# Altium project micromouse.PrjPcb
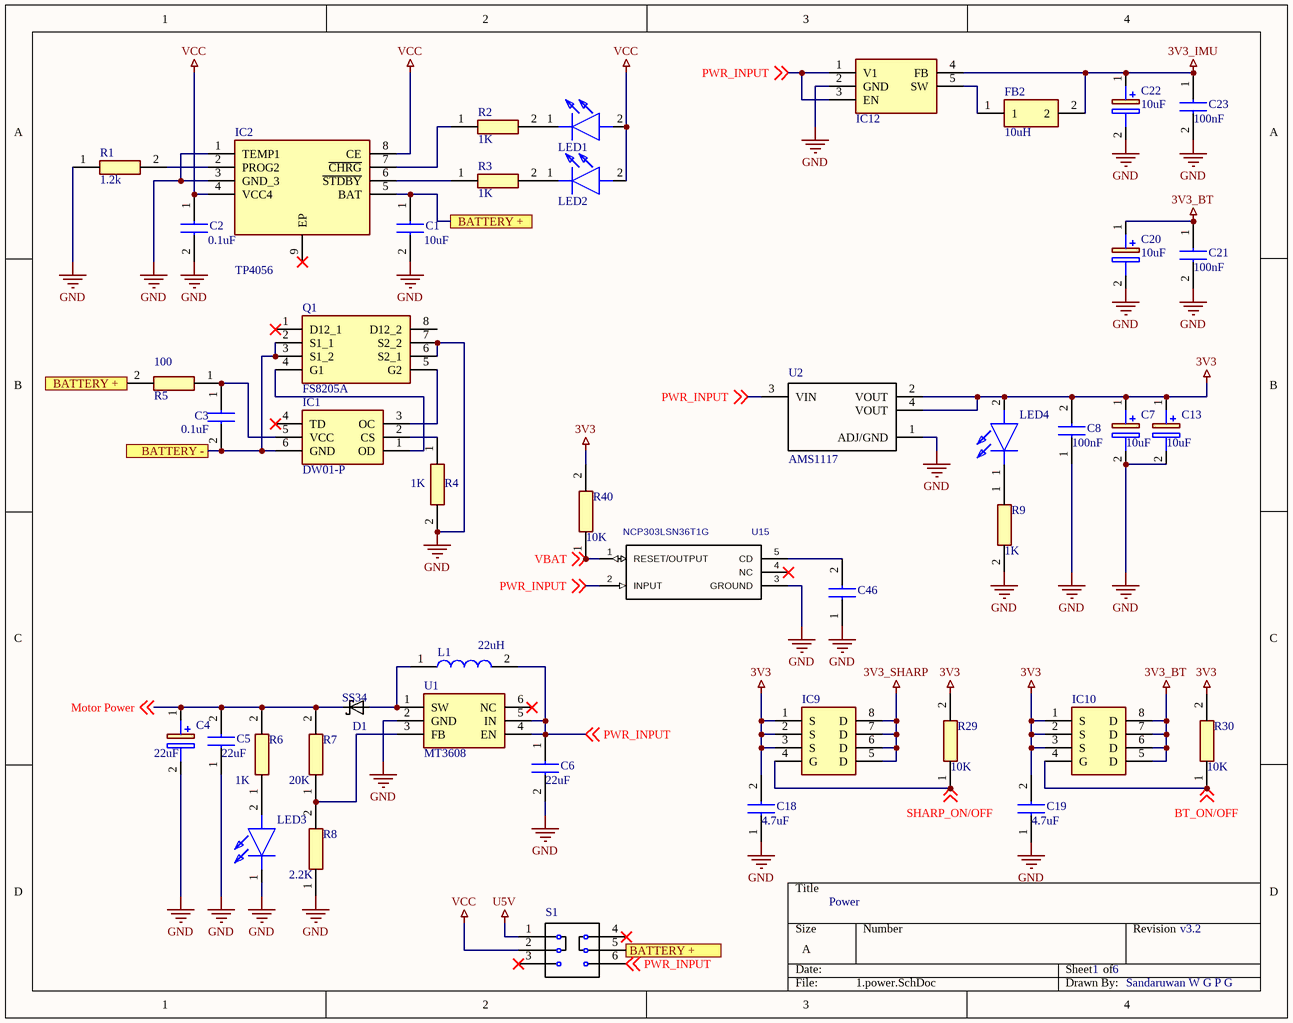
[diagram p0: 1.power.SchDoc]
Company: University of Peradeniya; Revision: V3
6 sheets, 164 parts. Net scope: flat (ports and power ports of the same name join across sheets).
Board file: micromouse pcb.PcbDoc
Sheets:
  1.power.SchDoc
  2.sensors.SchDoc
  3.motor drivers.SchDoc
  4.IMU.SchDoc
  5.Teensy.SchDoc
  6.STM32F103.SchDoc

## Sheet 1.power.SchDoc: Power Schematic
size A; DrawnBy: Pramod Sandaruwan; DocumentNumber: 1; Revision: V3; SheetNumber: 1; SheetTotal: 6

### Parts
C1  value 10uF  [CAPC2012X94N]  (hidden comment: 08055A101JAT2A)
C2  value 0.1uF  [CAPC2012X94N]  (hidden comment: 08055A101JAT2A)
C3  value 0.1uF  [CAPC2012X94N]  (hidden comment: 08055A101JAT2A)
C4  value 22uF  [CAPAE830X1050N]  (hidden comment: UUD1E221MNL1GS)
C5  value 22uF  [CAPC2012X94N]  (hidden comment: 08055A101JAT2A)
C6  value 22uF  [CAPC2012X94N]  (hidden comment: 08055A101JAT2A)
C7  value 10uF  [CAPPM3216X180N]  (hidden comment: tantalum capacitor 1206)
C8  value 100nF  [CAPC2012X94N]  (hidden comment: 08055A101JAT2A)
C13  value 10uF  [CAPPM3216X180N]  (hidden comment: tantalum capacitor 1206)
C18  value 4.7uF  [CAPC2012X94N]  (hidden comment: 08055A101JAT2A)
C19  value 4.7uF  [CAPC2012X94N]  (hidden comment: 08055A101JAT2A)
C20  value 10uF  [CAPPM3216X180N]  (hidden comment: tantalum capacitor 1206)
C21  value 100nF  [CAPC2012X94N]  (hidden comment: 08055A101JAT2A)
C22  value 10uF  [CAPPM3216X180N]  (hidden comment: tantalum capacitor 1206)
C23  value 100nF  [CAPC2012X94N]  (hidden comment: 08055A101JAT2A)
C46  08055A101JAT2A  [CAPC2012X94N]  (value not drawn)
D1  SS34  [*SMA]
FB2  value 10uH  [BEADC1608X95N]  (hidden comment: inductor 0603)
IC1  DW01-P  [SOT95P280X135-6N]
IC2  TP4056  [SOIC127P600X175-9N]
IC9  SI4143DY-T1-GE3  [SI4143DY-T1-GE3]  (value not drawn)
IC10  SI4143DY-T1-GE3  [SI4143DY-T1-GE3]  (value not drawn)
IC12  TPS62203  [SOT95P280X145-5N]  (value not drawn)
L1  value 22uH  [INDPM8080X420N]  (hidden comment: 74404084220)
LED1  150080BS75000  [LEDC2012X80N]  (value not drawn)
LED2  150080BS75000  [LEDC2012X80N]  (value not drawn)
LED3  150080BS75000  [LEDC2012X80N]  (value not drawn)
LED4  150080BS75000  [LEDC2012X80N]  (value not drawn)
Q1  FS8205A  [SOP65P640X120-8N]
R1  value 1.2k  [RESC2012X65N]  (hidden comment: CPF0805B100KE)
R2  value 1K  [RESC2012X65N]  (hidden comment: CPF0805B100KE)
R3  value 1K  [RESC2012X65N]  (hidden comment: CPF0805B100KE)
R4  value 1K  [RESC2012X65N]  (hidden comment: CPF0805B100KE)
R5  value 100  [RESC2012X65N]  (hidden comment: CPF0805B100KE)
R6  value 1K  [RESC2012X65N]  (hidden comment: CPF0805B100KE)
R7  value 20K  [RESC2012X65N]  (hidden comment: CPF0805B100KE)
R8  value 2.2K  [RESC2012X65N]  (hidden comment: CPF0805B100KE)
R9  value 1K  [RESC2012X65N]  (hidden comment: CPF0805B100KE)
R29  value 10K  [RESC2012X65N]  (hidden comment: CPF0805)
R30  value 10K  [RESC2012X65N]  (hidden comment: CPF0805)
R40  value 10K  [RESC2012X65N]  (hidden comment: CPF0805)
S1  1-1437575-7  [*SW_1-1437575-7]  (value not drawn)
U1  MT3608  [SOT95P280X145-6N]
U2  AMS1117  [*SOT229P700X180-4N]
U15  NCP303LSN36T1G  [TSOP-5]

### Ports
BATTERY +, BATTERY -

### Nets
3V3: C7.1(+) C8.2 C13.1(+) C18.2 C19.2 IC9.1(S) IC9.2(S) IC9.3(S) IC10.1(S) IC10.2(S) IC10.3(S) LED4.2(A) R29.2 R30.2 R40.2 U2.2(VOUT) U2.4(VOUT)
3V3_BT: C20.1(+) C21.1 IC10.5(D) IC10.6(D) IC10.7(D) IC10.8(D)
3V3_IMU: C22.1(+) C23.1 FB2.2 IC12.4(FB)
3V3_SHARP: IC9.5(D) IC9.6(D) IC9.7(D) IC9.8(D)
GND: C1.2 C2.2 C4.2(-) C5.1 C6.2 C7.2(-) C8.1 C13.2(-) C18.1 C19.1 C20.2(-) C21.2 C22.2(-) C23.2 C46.1 IC2.1(TEMP1) IC2.3(GND_3) IC12.2(GND) LED3.1(K) Q1.6(S2_1) Q1.7(S2_2) R1.1 R4.2 R8.1 R9.2 U1.2(GND) U2.1(ADJ/GND) U15.3(GROUND)
U5V: S1.1
VCC: C2.1 IC2.4(VCC4) IC2.8(CE) LED1.2(A) LED2.2(A) S1.2
BT_ON/OFF: IC10.4(G) R30.1 ; off-sheet BT_ON/OFF
Motor Power: C4.1(+) C5.2 D1.C R6.2 R7.2 ; off-sheet Motor Power
PWR_INPUT: C6.1 IC12.1(V1) IC12.3(EN) L1.2 S1.6 U1.4(EN) U1.5(IN) U2.3(VIN) U15.2(INPUT) ; off-sheet PWR_INPUT
SHARP_ON/OFF: IC9.4(G) R29.1 ; off-sheet SHARP_ON/OFF
VBAT: R40.1 U15.1(RESET/OUTPUT) ; off-sheet VBAT
NetC1_1: C1.1 IC2.5(BAT) R5.2 S1.5 ; port BATTERY +
NetC3_1: C3.1 IC1.5(VCC) R5.1
NetC3_2: C3.2 IC1.6(GND) Q1.2(S1_1) Q1.3(S1_2) ; port BATTERY -
NetC46_2: C46.2 U15.5(CD)
NetD1_A: D1.A L1.1 U1.1(SW)
NetFB2_1: FB2.1 IC12.5(SW)
NetIC1_1: IC1.1(OD) Q1.4(G1)
NetIC1_2: IC1.2(CS) R4.1
NetIC1_3: IC1.3(OC) Q1.5(G2)
NetIC2_2: IC2.2(PROG2) R1.2
NetIC2_6: IC2.6(~{STDBY}) R3.1
NetIC2_7: IC2.7(~{CHRG}) R2.1
NetLED1_1: LED1.1(K) R2.2
NetLED2_1: LED2.1(K) R3.2
NetLED3_2: LED3.2(A) R6.1
NetLED4_1: LED4.1(K) R9.1
NetR7_1: R7.1 R8.2 U1.3(FB)

Not connected (* = marked no-connect by the designer): IC1 4(TD)*; IC2 9(EP)*; Q1 1(D12_1)* 8(D12_2); S1 3* 4*; U1 6(NC)*; U15 4(NC)*

### Notes on the sheet
- Power
- v3.2
- Sandaruwan W G P G

### Library data of the parts
C1-C3 C5 C6 C8 C18 C19 C21 C23 C46 = 08055A101JAT2A: Capacitor; Manufacturer_Name: AVX; Allied_Number: 70474488; Datasheet Link: https://componentsearchengine.com/Datasheets/1/06031A100FAT2A.pdf; Height: 0.94mm; Manufacturer_Part_Number: 08055A101JAT2A; Mouser Part Number: 581-08055A101J; Mouser Price/Stock: https://www.mouser.com/Search/Refine.aspx?Keyword=581-08055A101J; RS Part Number: 0391000P; RS Price/Stock: http://uk.rs-online.com/web/p/products/0391000P; Allied Price/Stock: https://www.alliedelec.com/avx-08055a101jat2a/70474488/
C4 = UUD1E221MNL1GS: Capacitor Polarised; Manufacturer_Name: Nichicon; Allied_Number: 70409814; Datasheet Link: https://www.mouser.com/datasheet/2/293/e-uud-1513238.pdf; Height: 10.5mm; Manufacturer_Part_Number: UUD1E221MNL1GS; Mouser1 Part Number: 647-UUD1E221MNL; Mouser1 Price/Stock: https://www.mouser.com/Search/Refine.aspx?Keyword=647-UUD1E221MNL; RS Part Number: 7393453P; RS Price/Stock: http://uk.rs-online.com/web/p/products/7393453P; Allied Price/Stock: https://www.alliedelec.com/nichicon-uud1e221mnl1gs/70409814/
C7 C13 C20 C22 = tantalum capacitor 1206: Capacitor Polarised
D1 = SS34_1: Diode Schottky 40V 3A 2-Pin SMC T/R; MF: ON Semiconductor; MP: SS34; SnapEDA_Link: https://www.snapeda.com/parts/SS34/ON%20Semiconductor/view-part/?ref=snap; Price: None; Package: DO-214AB-214 ON Semiconductor; Availability: Unavailable; Value: *
FB2 = inductor 0603: Ferrite Bead
IC1 = DW01-P: Integrated Circuit; Manufacturer_Name: Fortune Semiconductor Corporation; Datasheet Link: https://cdn.sparkfun.com/assets/learn_tutorials/2/5/1/DW01-P_DataSheet_V10.pdf; Height: 1.35mm; Manufacturer_Part_Number: DW01-P
IC2 = TP4056: Integrated Circuit; Manufacturer_Name: NanJing Top Power; Datasheet Link: https://dlnmh9ip6v2uc.cloudfront.net/datasheets/Prototyping/TP4056.pdf; Height: 1.75mm; Manufacturer_Part_Number: TP4056
IC9 IC10 = SI4143DY-T1-GE3: Integrated Circuit
IC12 = TPS62203: Integrated Circuit
L1 = 74404084220: Inductor; Manufacturer_Name: Wurth Elektronik; Datasheet Link: https://katalog.we-online.de/pbs/datasheet/74404084220.pdf; Height: 4.2mm; Manufacturer_Part_Number: 74404084220; Mouser Part Number: 710-74404084220; Mouser Price/Stock: https://www.mouser.com/Search/Refine.aspx?Keyword=710-74404084220; RS Part Number: 8164733P; RS Price/Stock: http://uk.rs-online.com/web/p/products/8164733P
LED1-LED4 = 150080BS75000: LED; Manufacturer_Name: Wurth Elektronik; Datasheet Link: https://katalog.we-online.com/led/datasheet/150080BS75000.pdf; Height: 0.8mm; Manufacturer_Part_Number: 150080BS75000; Mouser Part Number: 710-150080BS75000; Mouser Price/Stock: https://www.mouser.com/Search/Refine.aspx?Keyword=710-150080BS75000; RS Part Number: 8154228P; RS Price/Stock: http://uk.rs-online.com/web/p/products/8154228P
Q1 = FS8205A: Transistor; Manufacturer_Name: SII Semiconductor; Datasheet Link: http://www.ic-fortune.com/upload/Download/FS8205A-DS-12_EN.pdf; Height: 1.2mm; Manufacturer_Part_Number: FS8205A
R1-R9 = CPF0805B100KE: Resistor; Manufacturer_Name: TE Connectivity; Allied_Number: 70286772; Datasheet Link: http://docs-europe.electrocomponents.com/webdocs/13d1/0900766b813d116f.pdf; Height: 0.65mm; Manufacturer_Part_Number: CPF0805B100KE; Mouser Part Number: 279-CPF0805B100KE; Mouser Price/Stock: https://www.mouser.com/Search/Refine.aspx?Keyword=279-CPF0805B100KE; RS Part Number: 6662673; RS Price/Stock: https://uk.rs-online.com/web/p/products/6662673; Allied Price/Stock: https://www.alliedelec.com/te-connectivity-cpf0805b100ke/70286772/
R29 R30 R40 = CPF0805: Resistor; Manufacturer_Name: TE Connectivity; Manufacturer_Part_Number: CPF0805B100KE; Allied_Number: 70286772; Datasheet Link: http://docs-europe.electrocomponents.com/webdocs/13d1/0900766b813d116f.pdf; Height: 0.65mm; Mouser Part Number: 279-CPF0805B100KE; Mouser Price/Stock: https://www.mouser.com/Search/Refine.aspx?Keyword=279-CPF0805B100KE; RS Part Number: 6662673; RS Price/Stock: https://uk.rs-online.com/web/p/products/6662673; Allied Price/Stock: https://www.alliedelec.com/te-connectivity-cpf0805b100ke/70286772/
S1 = 1-1437575-7: Slide Switch ON ON DPDT Top Slide 0.4VA 20VAC 20VDC 10000Cycle PC Pins Through Hole; MF: TE Connectivity; Price: None; Package: None; MP: 1-1437575-7; SnapEDA_Link: https://www.snapeda.com/parts/1-1437575-7/TE%20Connectivity%20ALCOSWITCH%20Switches/view-part/?ref=snap; Availability: Unavailable; TE_purchase_URL: https://www.te.com/usa-en/product-1-1437575-7.html?te_bu=Cor&te_type=disp&te_campaign=seda_glo_cor-seda-global-disp-prtnr-fy19-seda-model-bom-cta_sma-317_1&elqCampaignId=32493; Value: *
U1 = MT3608: Undefined or Miscellaneous; Manufacturer_Name: Aerosemi; Datasheet Link: https://www.olimex.com/Products/Breadboarding/BB-PWR-3608/resources/MT3608.pdf; Height: 1.45mm; Manufacturer_Part_Number: MT3608
U2 = AMS1117: 1A LOW DROPOUT VOLTAGE REGULATOR; MF: Seeed Technology; MP: AMS1117; SnapEDA_Link: https://www.snapeda.com/parts/AMS1117/Seeed%20Technology%20Co.%2C%20Ltd/view-part/?ref=snap; Price: None; Package: SOT-223 Seeed Technology; Availability: Unavailable; Value: *
U15 = NCP303LSN36T1G: C: Copyright (C) 2016 Accelerated Designs. All rights reserved; Vendor: ON Semiconductor; Value: NCP303LSN36T1G; Manufacturer_Part_Number: NCP303LSN36T1G; Copyright: Copyright (C) 2016 Accelerated Designs. All rights reserved

## Sheet 2.sensors.SchDoc: Sensor Schematic
size A; DocumentNumber: 2; Revision: V3; SheetNumber: 2; SheetTotal: 6
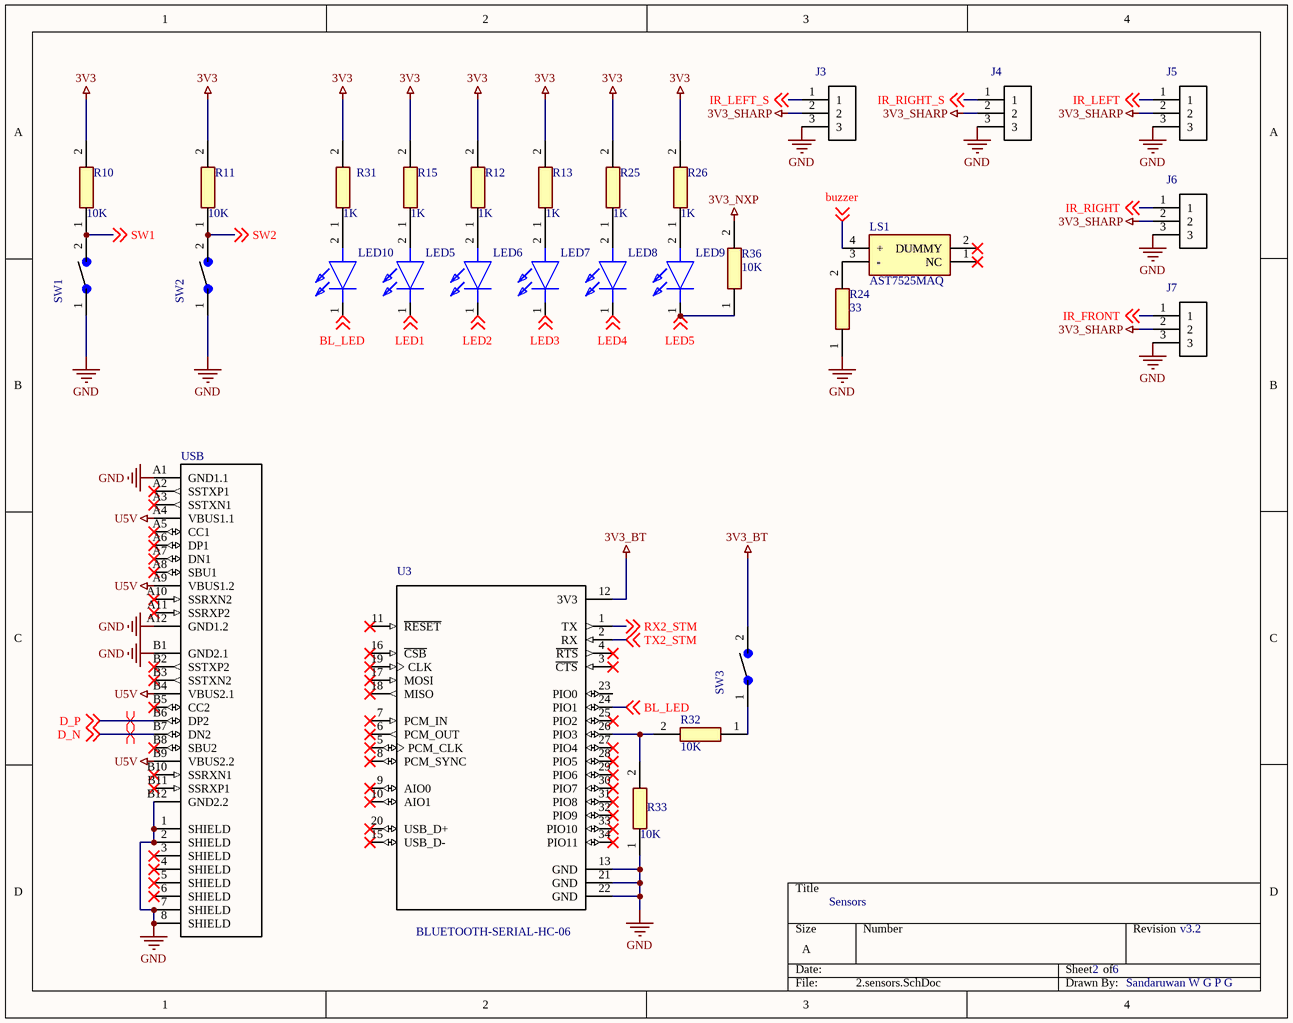
[diagram p1: 2.sensors.SchDoc]

### Parts
J3  0022057035_5268-03A  [*MOLEX_0022057035_5268-03A]  (value not drawn)
J4  0022057035_5268-03A  [*MOLEX_0022057035_5268-03A]  (value not drawn)
J5  0022057035_5268-03A  [*MOLEX_0022057035_5268-03A]  (value not drawn)
J6  0022057035_5268-03A  [*MOLEX_0022057035_5268-03A]  (value not drawn)
J7  0022057035_5268-03A  [*MOLEX_0022057035_5268-03A]  (value not drawn)
LED5  150080BS75000  [LEDC2012X80N]  (value not drawn)
LED6  150080BS75000  [LEDC2012X80N]  (value not drawn)
LED7  150080BS75000  [LEDC2012X80N]  (value not drawn)
LED8  150080BS75000  [LEDC2012X80N]  (value not drawn)
LED9  150080BS75000  [LEDC2012X80N]  (value not drawn)
LED10  150080BS75000  [LEDC2012X80N]  (value not drawn)
LS1  AST7525MAQ  [AST7525MAQ]
R10  value 10K  [RESC2012X65N]  (hidden comment: CPF0805B100KE)
R11  value 10K  [RESC2012X65N]  (hidden comment: CPF0805B100KE)
R12  value 1K  [RESC2012X65N]  (hidden comment: CPF0805B100KE)
R13  value 1K  [RESC2012X65N]  (hidden comment: CPF0805B100KE)
R15  value 1K  [RESC2012X65N]  (hidden comment: CPF0805B100KE)
R24  value 33  [RESC1608X55N]  (hidden comment: resistor)
R25  value 1K  [RESC2012X65N]  (hidden comment: CPF0805B100KE)
R26  value 1K  [RESC2012X65N]  (hidden comment: CPF0805B100KE)
R31  value 1K  [RESC2012X65N]  (hidden comment: CPF0805)
R32  value 10K  [RESC2012X65N]  (hidden comment: CPF0805)
R33  value 10K  [RESC2012X65N]  (hidden comment: CPF0805)
R36  value 10K  [RESC1608X55N]  (hidden comment: resistor)
SW1  1437566-3  [*TE_FSMSM]  (value not drawn)
SW2  1437566-3  [*TE_FSMSM]  (value not drawn)
SW3  1437566-3  [*TE_FSMSM]  (value not drawn)
U3  BLUETOOTH-SERIAL-HC-06  [*XCVR_BLUETOOTH-SERIAL-HC-06]
USB  USB4070-XX-X_REVC  [*GCT_USB4070-XX-X_REVC_USB4070-XX-X_REVC(Primary)]  (value not drawn)

### Nets
3V3: R10.2 R11.2 R12.2 R13.2 R15.2 R25.2 R26.2 R31.2
3V3_BT: SW3.2 U3.12(3V3)
3V3_NXP: R36.2
3V3_SHARP: J3.2 J4.2 J5.2 J6.2 J7.2
GND: J3.3 J4.3 J5.3 J6.3 J7.3 R24.1 R33.1 SW1.1 SW2.1 U3.13(GND) U3.21(GND) U3.22(GND) USB.1(SHIELD) USB.2(SHIELD) USB.7(SHIELD) USB.8(SHIELD) USB.A1(GND1.1) USB.A12(GND1.2) USB.B1(GND2.1) USB.B12(GND2.2)
U5V: USB.A4(VBUS1.1) USB.A9(VBUS1.2) USB.B4(VBUS2.1) USB.B9(VBUS2.2)
BL_LED: LED10.1(K) U3.24(PIO1) ; off-sheet BL_LED
buzzer: LS1.4(+) ; off-sheet buzzer
D_N: USB.B7(DN2) ; off-sheet D_N
D_P: USB.B6(DP2) ; off-sheet D_P
IR_FRONT: J7.1 ; off-sheet IR_FRONT
IR_LEFT: J5.1 ; off-sheet IR_LEFT
IR_LEFT_S: J3.1 ; off-sheet IR_LEFT_S
IR_RIGHT: J6.1 ; off-sheet IR_RIGHT
IR_RIGHT_S: J4.1 ; off-sheet IR_RIGHT_S
LED1: LED5.1(K) ; off-sheet LED1
LED2: LED6.1(K) ; off-sheet LED2
LED3: LED7.1(K) ; off-sheet LED3
LED4: LED8.1(K) ; off-sheet LED4
LED5: LED9.1(K) R36.1 ; off-sheet LED5
RX2_STM: U3.1(TX) ; off-sheet RX2_STM
SW1: R10.1 SW1.2 ; off-sheet SW1
SW2: R11.1 SW2.2 ; off-sheet SW2
TX2_STM: U3.2(RX) ; off-sheet TX2_STM
NetLED5_2: LED5.2(A) R15.1
NetLED6_2: LED6.2(A) R12.1
NetLED7_2: LED7.2(A) R13.1
NetLED8_2: LED8.2(A) R25.1
NetLED9_2: LED9.2(A) R26.1
NetLED10_2: LED10.2(A) R31.1
NetLS1_3: LS1.3(-) R24.2
NetR32_1: R32.1 SW3.1
NetR32_2: R32.2 R33.2 U3.26(PIO3)

Not connected (* = marked no-connect by the designer): LS1 1(NC)* 2(DUMMY)*; U3 3(~{CTS})* 4(~{RTS})* 5(PCM_CLK)* 6(PCM_OUT)* 7(PCM_IN)* 8(PCM_SYNC)* 9(AIO0)* 10(AIO1)* 11(~{RESET})* 15(USB_D-)* 16(~{CSB})* 17(MOSI)* 18(MISO)* 19(CLK)* 20(USB_D+)* 23(PIO0) 25(PIO2)* 27(PIO4)* 28(PIO5)* 29(PIO6)* 30(PIO7)* 31(PIO8)* 32(PIO9)* 33(PIO10)* 34(PIO11)*; USB 3(SHIELD)* 4(SHIELD)* 5(SHIELD)* 6(SHIELD)* A2(SSTXP1)* A3(SSTXN1)* A5(CC1)* A6(DP1)* A7(DN1)* A8(SBU1)* A10(SSRXN2)* A11(SSRXP2)* B2(SSTXP2)* B3(SSTXN2)* B5(CC2)* B8(SBU2)* B10(SSRXN1)* B11(SSRXP1)*

### Layout directives
differential pair: D_N, D_P

### Notes on the sheet
- Sensors
- v3.2
- Sandaruwan W G P G

### Library data of the parts
J3-J7 = 0022057035_5268-03A: Socket; wire-board; male; PIN: 3; 2.5mm; THT; SPOX; 3A; tinned; 20; MP: 0022057035 5268-03A; MF: Molex; Availability: Unavailable; Package: None; Price: None; SnapEDA_Link: https://www.snapeda.com/parts/0022057035%205268-03A/Molex/view-part/?ref=snap; Value: *
LED5-LED10 = 150080BS75000: LED; Manufacturer_Name: Wurth Elektronik; Datasheet Link: https://katalog.we-online.com/led/datasheet/150080BS75000.pdf; Height: 0.8mm; Manufacturer_Part_Number: 150080BS75000; Mouser Part Number: 710-150080BS75000; Mouser Price/Stock: https://www.mouser.com/Search/Refine.aspx?Keyword=710-150080BS75000; RS Part Number: 8154228P; RS Price/Stock: http://uk.rs-online.com/web/p/products/8154228P
LS1 = AST7525MAQ: Loudspeaker or Buzzer; Manufacturer_Name: Mallory Sonalert; Allied_Number: 70186690; Datasheet Link: https://www.mspindy.com/specifications/AST7525MAQ.PDF; Height: 2.5mm; Manufacturer_Part_Number: AST7525MAQ; Mouser Part Number: 539-AST7525MAQ; Mouser Price/Stock: https://www.mouser.com/Search/Refine.aspx?Keyword=539-AST7525MAQ; Allied Price/Stock: https://www.alliedelec.com/mallory-sonalert-ast7525maq/70186690/
R10-R13 R15 R25 R26 = CPF0805B100KE: as R1 on sheet 1.power; Datasheet Link: http://docs-europe.electrocomponents.com/webdocs/13d1/0900766b813d116f.pdf; Height: 0.65mm; Manufacturer_Part_Number: CPF0805B100KE; Mouser Part Number: 279-CPF0805B100KE; Mouser Price/Stock: https://www.mouser.com/Search/Refine.aspx?Keyword=279-CPF0805B100KE; RS Part Number: 6662673; RS Price/Stock: https://uk.rs-online.com/web/p/products/6662673; Allied Price/Stock: https://www.alliedelec.com/te-connectivity-cpf0805b100ke/70286772/
R31-R33 = CPF0805: as R29 on sheet 1.power; Datasheet Link: http://docs-europe.electrocomponents.com/webdocs/13d1/0900766b813d116f.pdf; Height: 0.65mm; Mouser Part Number: 279-CPF0805B100KE; Mouser Price/Stock: https://www.mouser.com/Search/Refine.aspx?Keyword=279-CPF0805B100KE; RS Part Number: 6662673; RS Price/Stock: https://uk.rs-online.com/web/p/products/6662673; Allied Price/Stock: https://www.alliedelec.com/te-connectivity-cpf0805b100ke/70286772/
SW1-SW3 = FSMSM: Switch Tactile OFF _ON_ SPST Rectangular Button Gull Wing 0.05A 12VDC SMD Loose Piece; MF: TE Connectivity; Configuration_Pole-Throw: Single Pole - Single Throw; Contact_Current_Rating: 50 mA; Availability: Unavailable; Price: None; Package: None; SnapEDA_Link: https://www.snapeda.com/parts/FSMSM/TE%20Connectivity%20ALCOSWITCH%20Switches/view-part/?ref=snap; MP: FSMSM; TE_purchase_URL: https://www.te.com/usa-en/product-1437566-3.html?te_bu=Cor&te_type=disp&te_campaign=seda_glo_cor-seda-global-disp-prtnr-fy19-seda-model-bom-cta_sma-317_1&elqCampaignId=32493; Value: *
U3 = BLUETOOTH-SERIAL-HC-06: Bluetooth Modules _802.15.1_ BLUETOOTH-SERIAL-HC-06; MF: Olimex; Price: None; MP: BLUETOOTH-SERIAL-HC-06; Package: None; SnapEDA_Link: https://www.snapeda.com/parts/BLUETOOTH-SERIAL-HC-06/Olimex/view-part/?ref=snap; Availability: Unavailable; Value: *
USB = USB4070-XX-X_REVC: Usb Type c Rec. 30 , Vertical, Smt With Stakes & Pegs, Tray; MP: USB4070-30-B; MF: Global Connector Technology; SnapEDA_Link: https://www.snapeda.com/parts/USB4070-30-B/Global%20Connector%20Technology/view-part/?ref=snap; Package: None; Price: None; Availability: Unavailable; Value: *

## Sheet 3.motor drivers.SchDoc
size A; DocumentNumber: 3; SheetNumber: 3; SheetTotal: 6
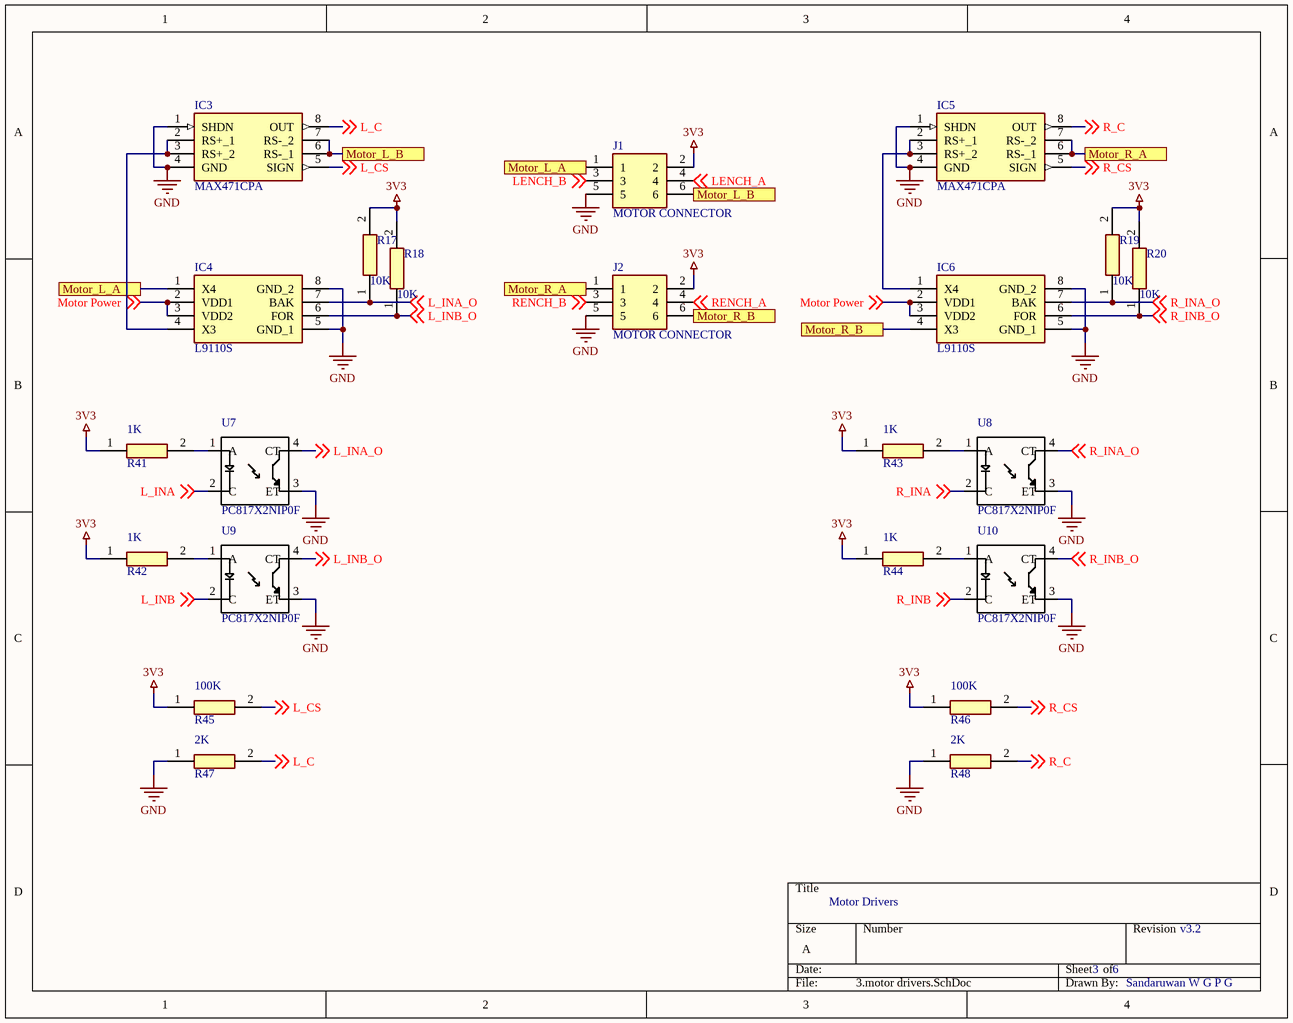
[diagram p2: 3.motor drivers.SchDoc]

### Parts
IC3  MAX471CPA  [SOIC127P600X175-8N]
IC4  L9110S  [SOIC127P600X175-8N]
IC5  MAX471CPA  [SOIC127P600X175-8N]
IC6  L9110S  [SOIC127P600X175-8N]
J1  MOTOR CONNECTOR  [533980671]
J2  MOTOR CONNECTOR  [533980671]
R17  value 10K  [RESC2012X65N]  (hidden comment: CPF0805B100KE)
R18  value 10K  [RESC2012X65N]  (hidden comment: CPF0805B100KE)
R19  value 10K  [RESC2012X65N]  (hidden comment: CPF0805B100KE)
R20  value 10K  [RESC2012X65N]  (hidden comment: CPF0805B100KE)
R41  value 1K  [RESC2012X65N]  (hidden comment: CPF0805)
R42  value 1K  [RESC2012X65N]  (hidden comment: CPF0805)
R43  value 1K  [RESC2012X65N]  (hidden comment: CPF0805)
R44  value 1K  [RESC2012X65N]  (hidden comment: CPF0805)
R45  value 100K  [RESC2012X65N]  (hidden comment: CPF0805)
R46  value 100K  [RESC2012X65N]  (hidden comment: CPF0805)
R47  value 2K  [RESC2012X65N]  (hidden comment: CPF0805)
R48  value 2K  [RESC2012X65N]  (hidden comment: CPF0805)
U7  PC817X2NIP0F  [*SOT254P975X400-4N]
U8  PC817X2NIP0F  [*SOT254P975X400-4N]
U9  PC817X2NIP0F  [*SOT254P975X400-4N]
U10  PC817X2NIP0F  [*SOT254P975X400-4N]

### Ports
Motor_L_A, Motor_L_B, Motor_R_A, Motor_R_B

### Nets
3V3: J1.2 J2.2 R17.2 R18.2 R19.2 R20.2 R41.1 R42.1 R43.1 R44.1 R45.1 R46.1
GND: IC3.1(SHDN) IC3.4(GND) IC4.5(GND_1) IC4.8(GND_2) IC5.1(SHDN) IC5.4(GND) IC6.5(GND_1) IC6.8(GND_2) J1.5 J2.5 R47.1 R48.1 U7.3(ET) U8.3(ET) U9.3(ET) U10.3(ET)
L_C: IC3.8(OUT) R47.2 ; off-sheet L_C
L_CS: IC3.5(SIGN) R45.2 ; off-sheet L_CS
L_INA: U7.2(C) ; off-sheet L_INA
L_INA_O: IC4.7(BAK) R17.1 U7.4(CT) ; off-sheet L_INA_O
L_INB: U9.2(C) ; off-sheet L_INB
L_INB_O: IC4.6(FOR) R18.1 U9.4(CT) ; off-sheet L_INB_O
LENCH_A: J1.4 ; off-sheet LENCH_A
LENCH_B: J1.3 ; off-sheet LENCH_B
Motor Power: IC4.2(VDD1) IC4.3(VDD2) IC6.2(VDD1) IC6.3(VDD2) ; off-sheet Motor Power
R_C: IC5.8(OUT) R48.2 ; off-sheet R_C
R_CS: IC5.5(SIGN) R46.2 ; off-sheet R_CS
R_INA: U8.2(C) ; off-sheet R_INA
R_INA_O: IC6.7(BAK) R19.1 U8.4(CT) ; off-sheet R_INA_O
R_INB: U10.2(C) ; off-sheet R_INB
R_INB_O: IC6.6(FOR) R20.1 U10.4(CT) ; off-sheet R_INB_O
RENCH_A: J2.4 ; off-sheet RENCH_A
RENCH_B: J2.3 ; off-sheet RENCH_B
NetIC3_2: IC3.2(RS+_1) IC3.3(RS+_2) IC4.4(X3)
NetIC3_6: IC3.6(RS-_1) IC3.7(RS-_2) J1.6 ; port Motor_L_B
NetIC4_1: IC4.1(X4) J1.1 ; port Motor_L_A
NetIC5_2: IC5.2(RS+_1) IC5.3(RS+_2) IC6.1(X4)
NetIC5_6: IC5.6(RS-_1) IC5.7(RS-_2) J2.1 ; port Motor_R_A
NetIC6_4: IC6.4(X3) J2.6 ; port Motor_R_B
NetR41_2: R41.2 U7.1(A)
NetR42_2: R42.2 U9.1(A)
NetR43_2: R43.2 U8.1(A)
NetR44_2: R44.2 U10.1(A)

### Notes on the sheet
- Motor Drivers
- v3.2
- Sandaruwan W G P G

### Library data of the parts
IC3 IC5 = MAX471CPA: Integrated Circuit; Manufacturer_Name: Maxim Integrated; Datasheet Link: https://pdfserv.maximintegrated.com/en/ds/MAX471-MAX472.pdf; Height: 1.75mm; Manufacturer_Part_Number: MAX471CPA; Mouser Part Number: 700-MAX471CPANR; Mouser Price/Stock: https://www.mouser.com/Search/Refine.aspx?Keyword=700-MAX471CPANR; RS Part Number: 0810352; RS Price/Stock: http://uk.rs-online.com/web/p/products/0810352
IC4 IC6 = L9110S: Integrated Circuit; Manufacturer_Name: Wuxi I-core Elec; Datasheet Link: https://datasheet.lcsc.com/szlcsc/Wuxi-Zhongwei-Aisin-Elec-L9110S_C85174.pdf; Height: 1.75mm; Manufacturer_Part_Number: L9110S
J1 J2 = 53398-0671: Connector; Manufacturer_Name: Molex; Allied_Number: 70090674; Datasheet Link: http://docs-emea.rs-online.com/webdocs/13c4/0900766b813c4502.pdf; Manufacturer_Part_Number: 53398-0671; Mouser Part Number: 538-53398-0671; Mouser Price/Stock: https://www.mouser.com/Search/Refine.aspx?Keyword=538-53398-0671; RS Part Number: 5427214P; RS Price/Stock: http://uk.rs-online.com/web/p/products/5427214P; Allied Price/Stock: http://www.alliedelec.com/molex-incorporated-53398-0671/70090674/
R17-R20 = CPF0805B100KE: as R1 on sheet 1.power; Datasheet Link: http://docs-europe.electrocomponents.com/webdocs/13d1/0900766b813d116f.pdf; Height: 0.65mm; Manufacturer_Part_Number: CPF0805B100KE; Mouser Part Number: 279-CPF0805B100KE; Mouser Price/Stock: https://www.mouser.com/Search/Refine.aspx?Keyword=279-CPF0805B100KE; RS Part Number: 6662673; RS Price/Stock: https://uk.rs-online.com/web/p/products/6662673; Allied Price/Stock: https://www.alliedelec.com/te-connectivity-cpf0805b100ke/70286772/
R41-R48 = CPF0805: as R29 on sheet 1.power; Datasheet Link: http://docs-europe.electrocomponents.com/webdocs/13d1/0900766b813d116f.pdf; Height: 0.65mm; Mouser Part Number: 279-CPF0805B100KE; Mouser Price/Stock: https://www.mouser.com/Search/Refine.aspx?Keyword=279-CPF0805B100KE; RS Part Number: 6662673; RS Price/Stock: https://uk.rs-online.com/web/p/products/6662673; Allied Price/Stock: https://www.alliedelec.com/te-connectivity-cpf0805b100ke/70286772/
U7-U10 = PC817X2NIP0F: Optocoupler DC-IN 1-CH Transistor DC-OUT 4-Pin PDIP SMD; MF: Sharp Microelectronics; Package: SMD-4 Sharp; Price: None; SnapEDA_Link: https://www.snapeda.com/parts/PC817X2NIP0F/Sharp%20Microelectronics/view-part/?ref=snap; MP: PC817X2NIP0F; Availability: Unavailable; Value: *

## Sheet 4.IMU.SchDoc
size A; DocumentNumber: 4; SheetNumber: 4; SheetTotal: 6
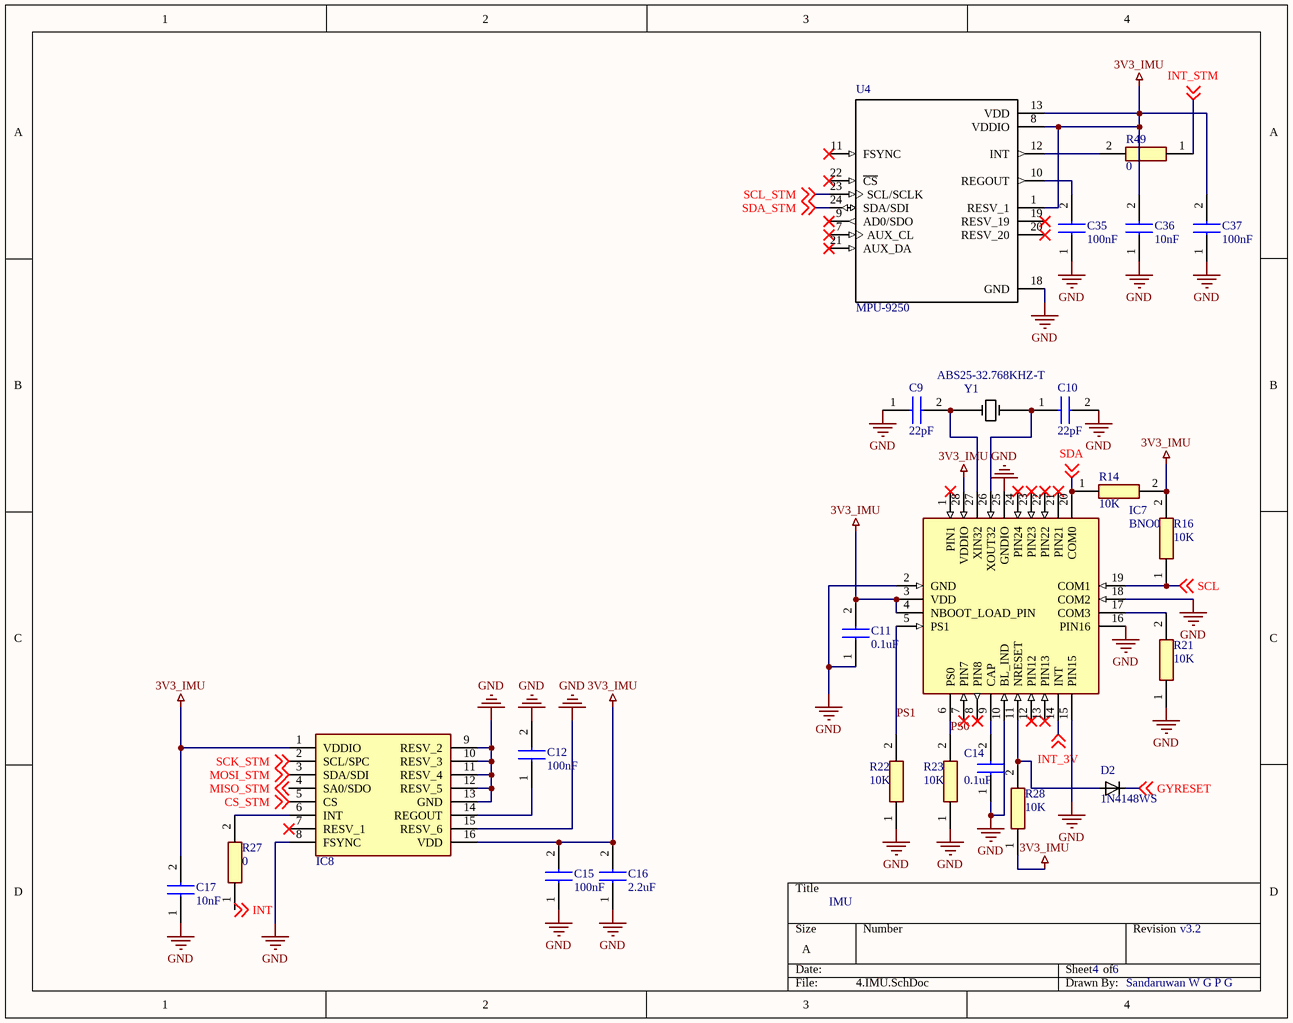
[diagram p3: 4.IMU.SchDoc]

### Parts
C9  value 22pF  [*CAPC1608X95N]  (hidden comment: capacitor 0603)
C10  value 22pF  [*CAPC1608X95N]  (hidden comment: capacitor 0603)
C11  value 0.1uF  [*CAPC1608X95N]  (hidden comment: capacitor 0603)
C12  value 100nF  [*CAPC1608X95N]  (hidden comment: capacitor 0603)
C14  value 0.1uF  [*CAPC1608X95N]  (hidden comment: capacitor 0603)
C15  value 100nF  [*CAPC1608X95N]  (hidden comment: capacitor 0603)
C16  value 2.2uF  [*CAPC1608X95N]  (hidden comment: capacitor 0603)
C17  value 10nF  [*CAPC1608X95N]  (hidden comment: capacitor 0603)
C35  value 100nF  [*CAPC1608X95N]  (hidden comment: capacitor 0603)
C36  value 10nF  [*CAPC1608X95N]  (hidden comment: capacitor 0603)
C37  value 100nF  [*CAPC1608X95N]  (hidden comment: capacitor 0603)
D2  1N4148WS  [*SOD323_1N4148WS(Primary)]
IC7  BNO055  [BNO055]
IC8  ICM20602  [PULL-BACK-QFN-16]  (value not drawn)
R14  value 10K  [RESC1608X55N]  (hidden comment: resistor)
R16  value 10K  [RESC1608X55N]  (hidden comment: resistor)
R21  value 10K  [RESC1608X55N]  (hidden comment: resistor)
R22  value 10K  [RESC1608X55N]  (hidden comment: resistor)
R23  value 10K  [RESC1608X55N]  (hidden comment: resistor)
R27  value 0  [RESC1608X55N]  (hidden comment: resistor)
R28  value 10K  [RESC1608X55N]  (hidden comment: resistor)
R49  value 0  [RESC1608X55N]  (hidden comment: resistor)
U4  MPU-9250  [*QFN40P300X300X105-24N]
Y1  ABS25-32.768KHZ-T  [*XTAL_ABS25-32.768KHZ-6-1-T]

### Nets
3V3_IMU: C11.2 C15.2 C16.2 C17.2 C36.2 C37.2 IC7.3(VDD) IC7.4(NBOOT_LOAD_PIN) IC7.28(VDDIO) IC8.1(VDDIO) IC8.16(VDD) R14.2 R16.2 R28.1 U4.1(RESV_1) U4.8(VDDIO) U4.13(VDD)
GND: C9.1 C10.2 C11.1 C12.2 C14.1 C15.1 C16.1 C17.1 C35.1 C36.1 C37.1 IC7.2(GND) IC7.10(BL_IND) IC7.15(PIN15) IC7.16(PIN16) IC7.18(COM2) IC7.25(GNDIO) IC8.8(FSYNC) IC8.9(RESV_2) IC8.10(RESV_3) IC8.11(RESV_4) IC8.12(RESV_5) IC8.13(GND) IC8.15(RESV_6) R21.1 R22.1 R23.1 U4.18(GND)
CS_STM: IC8.5(CS) ; off-sheet CS_STM
GYRESET: D2.C ; off-sheet GYRESET
INT: R27.1 ; off-sheet INT
INT_3V: IC7.14(INT) ; off-sheet INT_3V
INT_STM: R49.1 ; off-sheet INT_STM
MISO_STM: IC8.4(SA0/SDO) ; off-sheet MISO_STM
MOSI_STM: IC8.3(SDA/SDI) ; off-sheet MOSI_STM
PS0: IC7.6(PS0) R23.2
PS1: IC7.5(PS1) R22.2
SCK_STM: IC8.2(SCL/SPC) ; off-sheet SCK_STM
SCL: IC7.19(COM1) R16.1 ; off-sheet SCL
SCL_STM: U4.23(SCL/SCLK) ; off-sheet SCL_STM
SDA: IC7.20(COM0) R14.1 ; off-sheet SDA
SDA_STM: U4.24(SDA/SDI) ; off-sheet SDA_STM
NetC9_2: C9.2 IC7.27(XIN32) Y1.4
NetC10_1: C10.1 IC7.26(XOUT32) Y1.1
NetC12_1: C12.1 IC8.14(REGOUT)
NetC14_2: C14.2 IC7.9(CAP)
NetC35_2: C35.2 U4.10(REGOUT)
NetD2_A: D2.A IC7.11(NRESET) R28.2
NetIC7_17: IC7.17(COM3) R21.2
NetIC8_6: IC8.6(INT) R27.2
NetR49_2: R49.2 U4.12(INT)

Not connected (* = marked no-connect by the designer): IC7 1(PIN1)* 7(PIN7)* 8(PIN8)* 12(PIN12)* 13(PIN13)* 21(PIN21)* 22(PIN22)* 23(PIN23)* 24(PIN24)*; IC8 7(RESV_1)*; U4 7(AUX_CL)* 9(AD0/SDO)* 11(FSYNC)* 19(RESV_19)* 20(RESV_20)* 21(AUX_DA)* 22(~{CS})*

### Notes on the sheet
- IMU
- v3.2
- Sandaruwan W G P G

### Library data of the parts
C9-C12 C14-C17 C35-C37 = capacitor 0603: Capacitor
D2 = 1N4148WS: Diode Switching 75V 0.3A 2-Pin SOD-323 T/R; MF: ON Semiconductor; Price: None; Package: S-0 Good-Ark; MP: 1N4148WS; Availability: Unavailable; SnapEDA_Link: https://www.snapeda.com/parts/1N4148WS/ON%20Semiconductor/view-part/?ref=snap; Value: *
IC7 = BNO055: Integrated Circuit; Manufacturer_Name: Bosch Sensortec; Datasheet Link: https://ae-bst.resource.bosch.com/media/_tech/media/datasheets/BST_BNO055_DS000_14.pdf; Height: 1mm; Manufacturer_Part_Number: BNO055; Mouser Part Number: 262-BNO055; Mouser Price/Stock: https://www.mouser.com/Search/Refine.aspx?Keyword=262-BNO055
IC8 = ICM20602: Integrated Circuit
U4 = MPU-9250: IMUs - Inertial Measurement Units RECOMMENDED ALT 410-ICM-20948; MF: TDK InvenSense; Package: TFQFN-24 TDK InvenSense; Availability: Unavailable; MP: MPU-9250; SnapEDA_Link: https://www.snapeda.com/parts/MPU-9250/TDK%20InvenSense/view-part/?ref=snap; Price: None; Value: *
Y1 = ABS25-32.768KHZ-T: 32.768 Mhz Plastic Smt Low Pro; MF: Abracon LLC; Price: None; Package: None; MP: ABS25-32.768KHZ; Availability: Unavailable; SnapEDA_Link: https://www.snapeda.com/parts/ABS25-32.768KHZ/Abracon%20LLC/view-part/?ref=snap; Value: *

## Sheet 5.Teensy.SchDoc
size A; DocumentNumber: 5; SheetNumber: 5; SheetTotal: 6
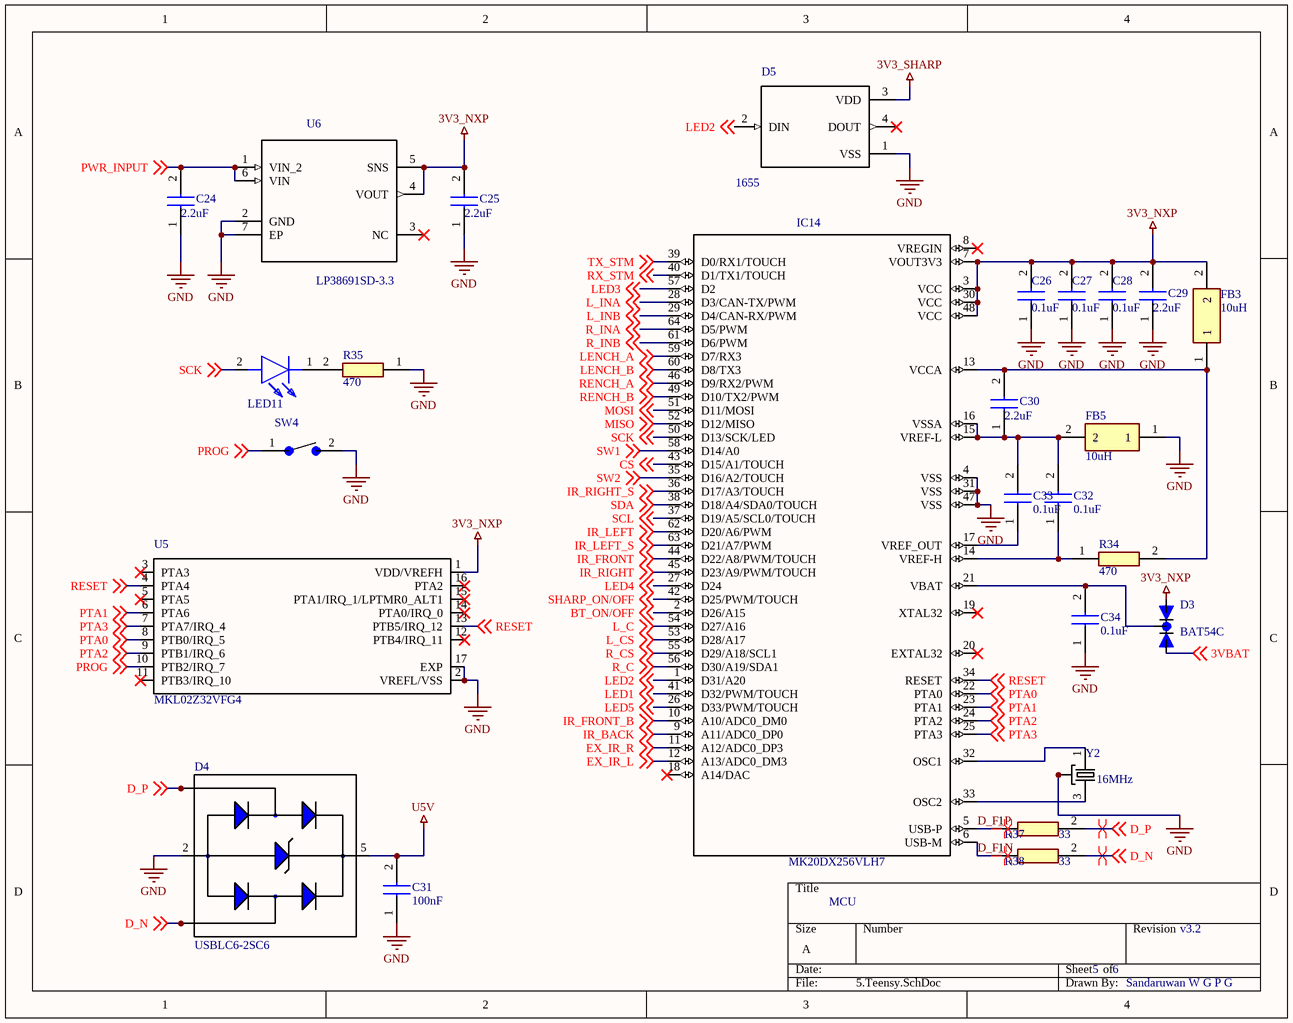
[diagram p4: 5.Teensy.SchDoc]

### Parts
C24  value 2.2uF  [CAPC2012X94N]  (hidden comment: 08055A101JAT2A)
C25  value 2.2uF  [CAPC2012X94N]  (hidden comment: 08055A101JAT2A)
C26  value 0.1uF  [*CAPC1608X95N]  (hidden comment: capacitor 0603)
C27  value 0.1uF  [*CAPC1608X95N]  (hidden comment: capacitor 0603)
C28  value 0.1uF  [*CAPC1608X95N]  (hidden comment: capacitor 0603)
C29  value 2.2uF  [CAPC2012X94N]  (hidden comment: 08055A101JAT2A)
C30  value 2.2uF  [CAPC2012X94N]  (hidden comment: 08055A101JAT2A)
C31  value 100nF  [*CAPC1608X95N]  (hidden comment: capacitor 0603)
C32  value 0.1uF  [*CAPC1608X95N]  (hidden comment: capacitor 0603)
C33  value 0.1uF  [*CAPC1608X95N]  (hidden comment: capacitor 0603)
C34  value 0.1uF  [*CAPC1608X95N]  (hidden comment: capacitor 0603)
D3  BAT54C  [*SOT23-R]
D4  USBLC6-2SC6  [*SOT95P280X145-6N]
D5  1655  [*LED_1655]
FB3  value 10uH  [BEADC1608X95N]  (hidden comment: inductor 0603)
FB5  value 10uH  [BEADC1608X95N]  (hidden comment: inductor 0603)
IC14  MK20DX256VLH7  [QFP50P1200X1200X160-64N]
LED11  150080BS75000  [LEDC2012X80N]  (value not drawn)
R34  value 470  [RESC1608X55N]  (hidden comment: resistor)
R35  value 470  [RESC1608X55N]  (hidden comment: resistor)
R37  value 33  [RESC1608X55N]  (hidden comment: resistor)
R38  value 33  [RESC1608X55N]  (hidden comment: resistor)
SW4  1437566-3  [*TE_FSMSM]  (value not drawn)
U5  MKL02Z32VFG4  [*QFN50P300X300X65-17N]
U6  LP38691SD-3.3  [*DFN300X300X80-7N]
Y2  value 16MHz  [*OSCCC320X250X60N]  (hidden comment: NX3225SA-12.000M-STD-CRS-2)

### Nets
3V3_NXP: C25.2 C26.2 C27.2 C28.2 C29.2 D3.2(A2) FB3.2 IC14.3(VCC) IC14.7(VOUT3V3) IC14.30(VCC) IC14.48(VCC) U5.1(VDD/VREFH) U6.4(VOUT) U6.5(SNS)
3V3_SHARP: D5.3(VDD)
GND: C24.1 C25.1 C26.1 C27.1 C28.1 C29.1 C31.1 C34.1 D4.2(GND) D5.1(VSS) FB5.1 IC14.4(VSS) IC14.31(VSS) IC14.47(VSS) R35.1 SW4.2 U5.2(VREFL/VSS) U5.17(EXP) U6.2(GND) U6.7(EP) Y2.2(GND) Y2.4(GND)
U5V: C31.2 D4.5(VBUS)
3VBAT: D3.1(A1) ; off-sheet 3VBAT
BT_ON/OFF: IC14.2(D26/A15) ; off-sheet BT_ON/OFF
CS: IC14.43(D15/A1/TOUCH) ; off-sheet CS
D_F_N: IC14.6(USB-M) R38.1
D_F_P: IC14.5(USB-P) R37.1
D_N: D4.3(I/O2) D4.4(I/O2) R38.2 ; off-sheet D_N
D_P: D4.1(I/O1) D4.6(I/O1) R37.2 ; off-sheet D_P
EX_IR_L: IC14.12(A13/ADC0_DM3) ; off-sheet EX_IR_L
EX_IR_R: IC14.11(A12/ADC0_DP3) ; off-sheet EX_IR_R
IR_BACK: IC14.9(A11/ADC0_DP0) ; off-sheet IR_BACK
IR_FRONT: IC14.44(D22/A8/PWM/TOUCH) ; off-sheet IR_FRONT
IR_FRONT_B: IC14.10(A10/ADC0_DM0) ; off-sheet IR_FRONT_B
IR_LEFT: IC14.62(D20/A6/PWM) ; off-sheet IR_LEFT
IR_LEFT_S: IC14.63(D21/A7/PWM) ; off-sheet IR_LEFT_S
IR_RIGHT: IC14.45(D23/A9/PWM/TOUCH) ; off-sheet IR_RIGHT
IR_RIGHT_S: IC14.36(D17/A3/TOUCH) ; off-sheet IR_RIGHT_S
L_C: IC14.54(D27/A16) ; off-sheet L_C
L_CS: IC14.53(D28/A17) ; off-sheet L_CS
L_INA: IC14.28(D3/CAN-TX/PWM) ; off-sheet L_INA
L_INB: IC14.29(D4/CAN-RX/PWM) ; off-sheet L_INB
LED1: IC14.41(D32/PWM/TOUCH) ; off-sheet LED1
LED2: D5.2(DIN) IC14.1(D31/A20) ; off-sheet LED2
LED3: IC14.57(D2) ; off-sheet LED3
LED4: IC14.27(D24) ; off-sheet LED4
LED5: IC14.26(D33/PWM/TOUCH) ; off-sheet LED5
LENCH_A: IC14.59(D7/RX3) ; off-sheet LENCH_A
LENCH_B: IC14.60(D8/TX3) ; off-sheet LENCH_B
MISO: IC14.52(D12/MISO) ; off-sheet MISO
MOSI: IC14.51(D11/MOSI) ; off-sheet MOSI
PROG: SW4.1 U5.10(PTB2/IRQ_7) ; off-sheet PROG
PTA0: IC14.22(PTA0) U5.8(PTB0/IRQ_5) ; off-sheet PTA0
PTA1: IC14.23(PTA1) U5.6(PTA6) ; off-sheet PTA1
PTA2: IC14.24(PTA2) U5.9(PTB1/IRQ_6) ; off-sheet PTA2
PTA3: IC14.25(PTA3) U5.7(PTA7/IRQ_4) ; off-sheet PTA3
PWR_INPUT: C24.2 U6.1(VIN_2) U6.6(VIN) ; off-sheet PWR_INPUT
R_C: IC14.56(D30/A19/SDA1) ; off-sheet R_C
R_CS: IC14.55(D29/A18/SCL1) ; off-sheet R_CS
R_INA: IC14.64(D5/PWM) ; off-sheet R_INA
R_INB: IC14.61(D6/PWM) ; off-sheet R_INB
RENCH_A: IC14.46(D9/RX2/PWM) ; off-sheet RENCH_A
RENCH_B: IC14.49(D10/TX2/PWM) ; off-sheet RENCH_B
RESET: IC14.34(RESET) U5.4(PTA4) U5.13(PTB5/IRQ_12) ; off-sheet RESET
RX_STM: IC14.40(D1/TX1/TOUCH) ; off-sheet RX_STM
SCK: IC14.50(D13/SCK/LED) LED11.2(A) ; off-sheet SCK
SCL: IC14.37(D19/A5/SCL0/TOUCH) ; off-sheet SCL
SDA: IC14.38(D18/A4/SDA0/TOUCH) ; off-sheet SDA
SHARP_ON/OFF: IC14.42(D25/PWM/TOUCH) ; off-sheet SHARP_ON/OFF
SW1: IC14.58(D14/A0) ; off-sheet SW1
SW2: IC14.35(D16/A2/TOUCH) ; off-sheet SW2
TX_STM: IC14.39(D0/RX1/TOUCH) ; off-sheet TX_STM
NetC30_1: C30.1 C32.2 C33.2 FB5.2 IC14.15(VREF-L) IC14.16(VSSA)
NetC30_2: C30.2 FB3.1 IC14.13(VCCA) R34.2
NetC32_1: C32.1 IC14.14(VREF-H) R34.1
NetC33_1: C33.1 IC14.17(VREF_OUT)
NetC34_2: C34.2 D3.3(C) IC14.21(VBAT)
NetIC14_32: IC14.32(OSC1) Y2.1
NetIC14_33: IC14.33(OSC2) Y2.3
NetLED11_1: LED11.1(K) R35.2

Not connected (* = marked no-connect by the designer): D5 4(DOUT)*; IC14 8(VREGIN)* 18(A14/DAC)* 19(XTAL32)* 20(EXTAL32)*; U5 3(PTA3)* 5(PTA5)* 11(PTB3/IRQ_10)* 12(PTB4/IRQ_11)* 14(PTA0/IRQ_0)* 15(PTA1/IRQ_1/LPTMR0_ALT1)* 16(PTA2)*; U6 3(NC)*

### Layout directives
differential pair: D_F_N, D_F_P, D_N, D_P

### Notes on the sheet
- MCU
- v3.2
- Sandaruwan W G P G

### Library data of the parts
C24 C25 C29 C30 = 08055A101JAT2A: as C1 on sheet 1.power; Datasheet Link: https://componentsearchengine.com/Datasheets/1/06031A100FAT2A.pdf; Height: 0.94mm; Manufacturer_Part_Number: 08055A101JAT2A; Mouser Part Number: 581-08055A101J; Mouser Price/Stock: https://www.mouser.com/Search/Refine.aspx?Keyword=581-08055A101J; RS Part Number: 0391000P; RS Price/Stock: http://uk.rs-online.com/web/p/products/0391000P; Allied Price/Stock: https://www.alliedelec.com/avx-08055a101jat2a/70474488/
C26-C28 C31-C34 = capacitor 0603: Capacitor
D3 = BAT54C: MF: ON Semiconductor; Package: SOT-23-3 ON Semiconductor; Availability: Unavailable; MP: BAT54C; SnapEDA_Link: https://www.snapeda.com/parts/BAT54C/ON%20Semiconductor/view-part/?ref=snap; Price: None; Value: *
D4 = USBLC6-2SC6: USBLC6 Series 2 Line 6 V Uni / Bi-Directional ESD Protection - SOT-23-6; MF: STMicroelectronics; Package: SOT-23-6 STMicroelectronics; Price: None; SnapEDA_Link: https://www.snapeda.com/parts/USBLC6-2SC6/STMicroelectronics/view-part/?ref=snap; MP: USBLC6-2SC6; Availability: Unavailable; Value: *
D5 = 1655: Addressable Lighting Neopixel 10 LED Discrete Serial _Shift Register_ Red, Green, Blue _RGB_ 5.00mm L x 5.00mm W; MF: Adafruit; Digi-Key_Part_Number: 1528-1104-ND; MP: 1655; Package: TO-3 Adafruit; SnapEDA_Link: https://www.snapeda.com/parts/1655/Adafruit%20Industries/view-part/4299409/?ref=snap; Digi-Key_Purchase_URL: https://www.digikey.lk/product-detail/en/adafruit-industries-llc/1655/1528-1104-ND/5154679?utm_source=snapeda&utm_medium=aggregator&utm_campaign=symbol; Value: *
FB3 FB5 = inductor 0603: Ferrite Bead
IC14 = MK20DX256VLH7_1: Kinetis K20: 72MHz Cortex-M4 Performance MCU, 288KB Flash, 64KB SRAM, Full-Speed USB, 64-LQFP; MF: NXP USA; Package: LQFP-64 NXP Semiconductors; Availability: Unavailable; MP: MK20DX256VLH7; SnapEDA_Link: https://www.snapeda.com/parts/MK20DX256VLH7/NXP%20USA%20Inc./view-part/?ref=snap; Price: None; Value: *
LED11 = 150080BS75000: LED; Manufacturer_Name: Wurth Elektronik; Datasheet Link: https://katalog.we-online.com/led/datasheet/150080BS75000.pdf; Height: 0.8mm; Manufacturer_Part_Number: 150080BS75000; Mouser Part Number: 710-150080BS75000; Mouser Price/Stock: https://www.mouser.com/Search/Refine.aspx?Keyword=710-150080BS75000; RS Part Number: 8154228P; RS Price/Stock: http://uk.rs-online.com/web/p/products/8154228P
SW4 = FSMSM: as SW1 on sheet 2.sensors; Availability: Unavailable; Price: None; Package: None; SnapEDA_Link: https://www.snapeda.com/parts/FSMSM/TE%20Connectivity%20ALCOSWITCH%20Switches/view-part/?ref=snap; MP: FSMSM; TE_purchase_URL: https://www.te.com/usa-en/product-1437566-3.html?te_bu=Cor&te_type=disp&te_campaign=seda_glo_cor-seda-global-disp-prtnr-fy19-seda-model-bom-cta_sma-317_1&elqCampaignId=32493; Value: *
U5 = MKL02Z32VFG4_1: 32 Bit Microcontroller, Kinetis L Series Ultra Low Power, ARM Cortex-M0+, 48 MHz, 32 KB, 4 KB, 16; MF: NXP USA; Package: QFN-16 NXP Semiconductors; Availability: Unavailable; MP: MKL02Z32VFG4; SnapEDA_Link: https://www.snapeda.com/parts/MKL02Z32VFG4/NXP%20USA%20Inc./view-part/?ref=snap; Price: None; Value: *
U6 = LP38691SD-3.3: 500mA Low Dropout CMOS Linear Regulators Stable with Ceramic Output Capacitors 6-WSON -40 to 125; MF: Texas Instruments; MP: LP38691SD-3.3; Price: None; SnapEDA_Link: https://www.snapeda.com/parts/LP38691SD-3.3/Texas%20Instruments/view-part/?ref=snap; Availability: Unavailable; Package: WDFN-6 Texas Instruments; Value: *
Y2 = NX3225SA-12.000M-STD-CRS-2: Crystal 12.0000mhz 8pf Smd; MF: NDK America,; MP: NX3225SA-12.000M-STD-CRS-2; Price: None; SnapEDA_Link: https://www.snapeda.com/parts/NX3225SA-12.000M-STD-CRS-2/NDK%20America%2C%20Inc./view-part/?ref=snap; Availability: Unavailable; Package: SMD-4 NDK America

## Sheet 6.STM32F103.SchDoc
size A; DocumentNumber: 6; SheetNumber: 6; SheetTotal: 6
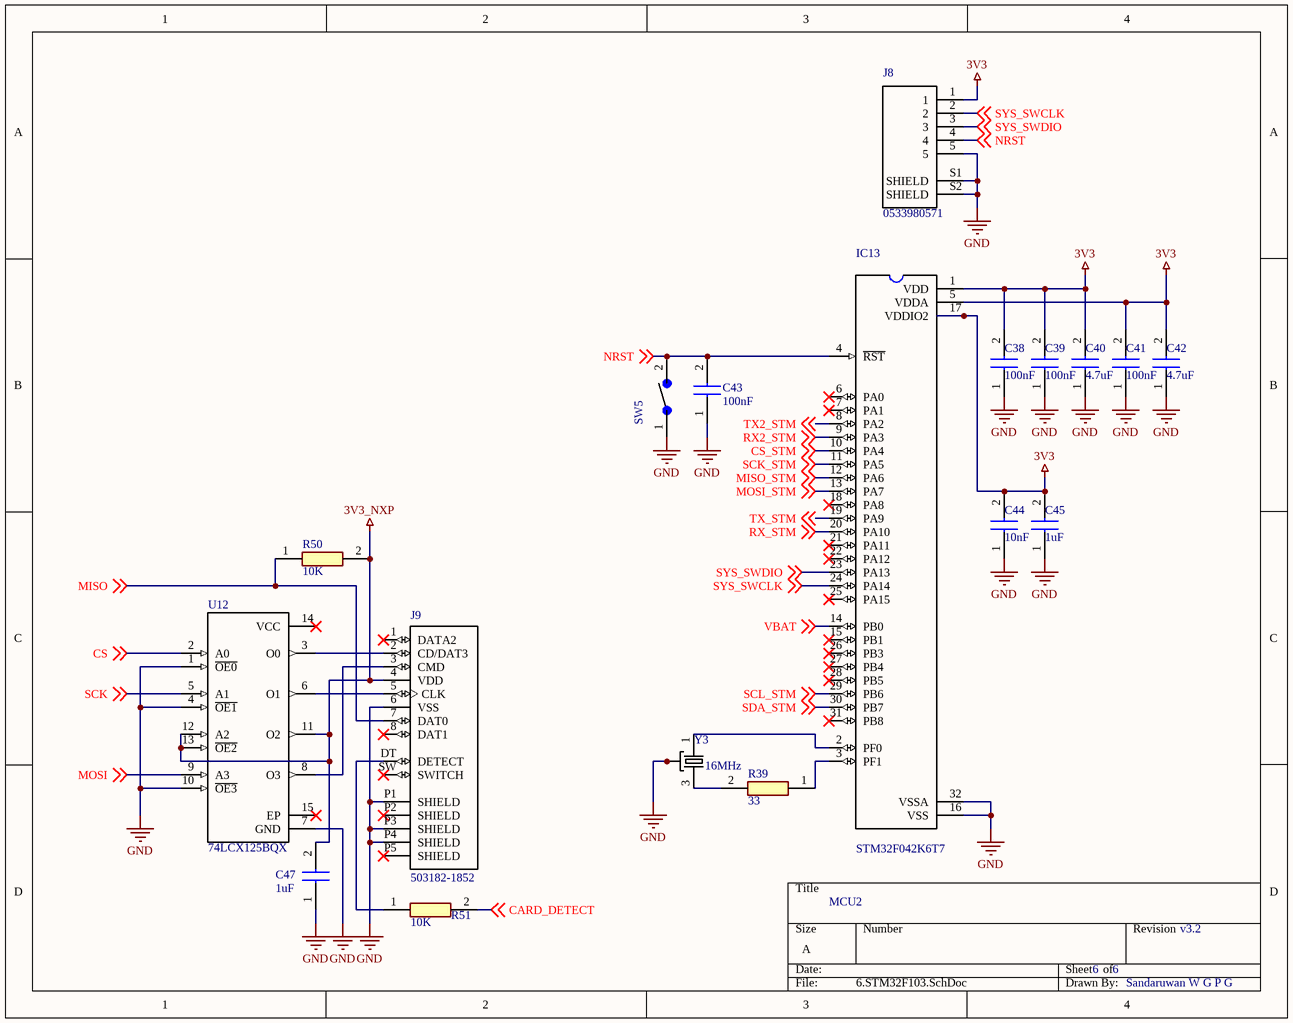
[diagram p5: 6.STM32F103.SchDoc]

### Parts
C38  value 100nF  [*CAPC1608X95N]  (hidden comment: capacitor 0603)
C39  value 100nF  [*CAPC1608X95N]  (hidden comment: capacitor 0603)
C40  value 4.7uF  [*CAPC1608X95N]  (hidden comment: capacitor 0603)
C41  value 100nF  [*CAPC1608X95N]  (hidden comment: capacitor 0603)
C42  value 4.7uF  [*CAPC1608X95N]  (hidden comment: capacitor 0603)
C43  value 100nF  [*CAPC1608X95N]  (hidden comment: capacitor 0603)
C44  value 10nF  [*CAPC1608X95N]  (hidden comment: capacitor 0603)
C45  value 1uF  [*CAPC1608X95N]  (hidden comment: capacitor 0603)
C47  value 1uF  [*CAPC1608X95N]  (hidden comment: capacitor 0603)
IC13  STM32F042K6T7  [*QFP80P900X900X160-32N]
J8  0533980571  [*MOLEX_0533980571_0533980571(Primary)]
J9  503182-1852  [*MOLEX_503182-1852_503182-1852(Primary)]
R39  value 33  [RESC1608X55N]  (hidden comment: resistor)
R50  value 10K  [RESC1608X55N]  (hidden comment: resistor)
R51  value 10K  [RESC1608X55N]  (hidden comment: resistor)
SW5  1437566-3  [*TE_FSMSM]  (value not drawn)
U12  74LCX125BQX  [*QFN50P300X250X85-15N]
Y3  value 16MHz  [*OSCCC320X250X60N]  (hidden comment: NX3225SA-12.000M-STD-CRS-2)

### Nets
3V3: C38.2 C39.2 C40.2 C41.2 C42.2 C44.2 C45.2 IC13.1(VDD) IC13.5(VDDA) IC13.17(VDDIO2) J8.1
3V3_NXP: C47.2 J9.4(VDD) R50.2 U12.11(O2) U12.12(A2) U12.13(~{OE2})
GND: C38.1 C39.1 C40.1 C41.1 C42.1 C43.1 C44.1 C45.1 C47.1 IC13.16(VSS) IC13.32(VSSA) J8.5 J8.S1(SHIELD) J8.S2(SHIELD) J9.6(VSS) J9.P1(SHIELD) J9.P3(SHIELD) J9.P4(SHIELD) SW5.1 U12.1(~{OE0}) U12.4(~{OE1}) U12.7(GND) U12.10(~{OE3}) Y3.2(GND) Y3.4(GND)
CARD_DETECT: R51.2 ; off-sheet CARD_DETECT
CS: U12.2(A0) ; off-sheet CS
CS_STM: IC13.10(PA4) ; off-sheet CS_STM
MISO: J9.7(DAT0) R50.1 ; off-sheet MISO
MISO_STM: IC13.12(PA6) ; off-sheet MISO_STM
MOSI: U12.9(A3) ; off-sheet MOSI
MOSI_STM: IC13.13(PA7) ; off-sheet MOSI_STM
NRST: C43.2 IC13.4(~{RST}) J8.4 SW5.2 ; off-sheet NRST
RX2_STM: IC13.9(PA3) ; off-sheet RX2_STM
RX_STM: IC13.20(PA10) ; off-sheet RX_STM
SCK: U12.5(A1) ; off-sheet SCK
SCK_STM: IC13.11(PA5) ; off-sheet SCK_STM
SCL_STM: IC13.29(PB6) ; off-sheet SCL_STM
SDA_STM: IC13.30(PB7) ; off-sheet SDA_STM
SYS_SWCLK: IC13.24(PA14) J8.2 ; off-sheet SYS_SWCLK
SYS_SWDIO: IC13.23(PA13) J8.3 ; off-sheet SYS_SWDIO
TX2_STM: IC13.8(PA2) ; off-sheet TX2_STM
TX_STM: IC13.19(PA9) ; off-sheet TX_STM
VBAT: IC13.14(PB0) ; off-sheet VBAT
NetIC13_2: IC13.2(PF0) Y3.1
NetIC13_3: IC13.3(PF1) R39.1
NetJ9_2: J9.2(CD/DAT3) U12.3(O0)
NetJ9_3: J9.3(CMD) U12.8(O3)
NetJ9_5: J9.5(CLK) U12.6(O1)
NetJ9_DT: J9.DT(DETECT) R51.1
NetR39_2: R39.2 Y3.3

Not connected (* = marked no-connect by the designer): IC13 6(PA0)* 7(PA1)* 15(PB1)* 18(PA8)* 21(PA11)* 22(PA12)* 25(PA15)* 26(PB3)* 27(PB4)* 28(PB5)* 31(PB8)*; J9 1(DATA2)* 8(DAT1)* P2(SHIELD)* P5(SHIELD)* SW(SWITCH)*; U12 14(VCC)* 15(EP)*

### Notes on the sheet
- MCU2
- v3.2
- Sandaruwan W G P G

### Library data of the parts
C38-C45 C47 = capacitor 0603: Capacitor
IC13 = STM32F042K6T7: Entry-level ARM Cortex-M0 USB line MCU with 32 Kbytes Flash, 48 MHz CPU, USB, CAN and CEC functions; MF: STMicroelectronics; MP: STM32F042K6T7; Package: LQFP-32 STMicroelectronics; SnapEDA_Link: https://www.snapeda.com/parts/STM32F042K6T7/STMicroelectronics/view-part/?ref=snap; Price: None; Availability: Unavailable; Value: *
J8 = 0533980571: Conn Shrouded Header HDR 5 POS 1.25mm Solder ST SMD PicoBladeÃƒÂ¢Ã¢Â€ÂžÂ¢ Embossed T/R /; MF: Molex; MP: 0533980571; Availability: Unavailable; SnapEDA_Link: https://www.snapeda.com/parts/0533980571/Molex/view-part/472893/?ref=snap; Package: None; Price: None; Value: *
J9 = 503182-1852: MICRO SD NORMAL ULTRALOWPRO8CKTE; MF: Molex; MP: 5031821852; Availability: Unavailable; Package: None; Price: None; SnapEDA_Link: https://www.snapeda.com/parts/5031821852/Molex/view-part/?ref=snap; Value: *
SW5 = FSMSM: as SW1 on sheet 2.sensors; Availability: Unavailable; Price: None; Package: None; SnapEDA_Link: https://www.snapeda.com/parts/FSMSM/TE%20Connectivity%20ALCOSWITCH%20Switches/view-part/?ref=snap; MP: FSMSM; TE_purchase_URL: https://www.te.com/usa-en/product-1437566-3.html?te_bu=Cor&te_type=disp&te_campaign=seda_glo_cor-seda-global-disp-prtnr-fy19-seda-model-bom-cta_sma-317_1&elqCampaignId=32493; Value: *
U12 = 74LCX125BQX: Buffer/Line Driver 4-CH Non-Inverting 3-ST CMOS 14-Pin DQFN EP T/R; MF: ON Semiconductor; Price: None; MP: 74LCX125BQX; Availability: Unavailable; Package: DQFN-14 Fairchild Semiconductor; SnapEDA_Link: https://www.snapeda.com/parts/74LCX125BQX/ON%20Semiconductor/view-part/?ref=snap; Value: *
Y3 = NX3225SA-12.000M-STD-CRS-2: as Y2 on sheet 5.Teensy; MP: NX3225SA-12.000M-STD-CRS-2; Price: None; SnapEDA_Link: https://www.snapeda.com/parts/NX3225SA-12.000M-STD-CRS-2/NDK%20America%2C%20Inc./view-part/?ref=snap; Availability: Unavailable; Package: SMD-4 NDK America

## Nets that join several sheets
3V3: 1.power (17 pins), 2.sensors (8 pins), 3.motor drivers (12 pins), 6.STM32F103 (11 pins)
3V3_BT: 1.power (6 pins), 2.sensors (SW3.2 U3.12)
3V3_IMU: 1.power (C22.1 C23.1 FB2.2 IC12.4), 4.IMU (17 pins)
3V3_NXP: 2.sensors (R36.2), 5.Teensy (14 pins), 6.STM32F103 (6 pins)
3V3_SHARP: 1.power (IC9.5 IC9.6 IC9.7 IC9.8), 2.sensors (5 pins), 5.Teensy (D5.3)
GND: 1.power (28 pins), 2.sensors (20 pins), 3.motor drivers (16 pins), 4.IMU (28 pins), 5.Teensy (22 pins), 6.STM32F103 (25 pins)
U5V: 1.power (S1.1), 2.sensors (USB.A4 USB.A9 USB.B4 USB.B9), 5.Teensy (C31.2 D4.5)
BT_ON/OFF: 1.power (IC10.4 R30.1), 5.Teensy (IC14.2)
CS: 5.Teensy (IC14.43), 6.STM32F103 (U12.2)
CS_STM: 4.IMU (IC8.5), 6.STM32F103 (IC13.10)
D_N: 2.sensors (USB.B7), 5.Teensy (D4.3 D4.4 R38.2)
D_P: 2.sensors (USB.B6), 5.Teensy (D4.1 D4.6 R37.2)
IR_FRONT: 2.sensors (J7.1), 5.Teensy (IC14.44)
IR_LEFT: 2.sensors (J5.1), 5.Teensy (IC14.62)
IR_LEFT_S: 2.sensors (J3.1), 5.Teensy (IC14.63)
IR_RIGHT: 2.sensors (J6.1), 5.Teensy (IC14.45)
IR_RIGHT_S: 2.sensors (J4.1), 5.Teensy (IC14.36)
L_C: 3.motor drivers (IC3.8 R47.2), 5.Teensy (IC14.54)
L_CS: 3.motor drivers (IC3.5 R45.2), 5.Teensy (IC14.53)
L_INA: 3.motor drivers (U7.2), 5.Teensy (IC14.28)
L_INB: 3.motor drivers (U9.2), 5.Teensy (IC14.29)
LED1: 2.sensors (LED5.1), 5.Teensy (IC14.41)
LED2: 2.sensors (LED6.1), 5.Teensy (D5.2 IC14.1)
LED3: 2.sensors (LED7.1), 5.Teensy (IC14.57)
LED4: 2.sensors (LED8.1), 5.Teensy (IC14.27)
LED5: 2.sensors (LED9.1 R36.1), 5.Teensy (IC14.26)
LENCH_A: 3.motor drivers (J1.4), 5.Teensy (IC14.59)
LENCH_B: 3.motor drivers (J1.3), 5.Teensy (IC14.60)
MISO: 5.Teensy (IC14.52), 6.STM32F103 (J9.7 R50.1)
MISO_STM: 4.IMU (IC8.4), 6.STM32F103 (IC13.12)
MOSI: 5.Teensy (IC14.51), 6.STM32F103 (U12.9)
MOSI_STM: 4.IMU (IC8.3), 6.STM32F103 (IC13.13)
Motor Power: 1.power (5 pins), 3.motor drivers (IC4.2 IC4.3 IC6.2 IC6.3)
PWR_INPUT: 1.power (9 pins), 5.Teensy (C24.2 U6.1 U6.6)
R_C: 3.motor drivers (IC5.8 R48.2), 5.Teensy (IC14.56)
R_CS: 3.motor drivers (IC5.5 R46.2), 5.Teensy (IC14.55)
R_INA: 3.motor drivers (U8.2), 5.Teensy (IC14.64)
R_INB: 3.motor drivers (U10.2), 5.Teensy (IC14.61)
RENCH_A: 3.motor drivers (J2.4), 5.Teensy (IC14.46)
RENCH_B: 3.motor drivers (J2.3), 5.Teensy (IC14.49)
RX2_STM: 2.sensors (U3.1), 6.STM32F103 (IC13.9)
RX_STM: 5.Teensy (IC14.40), 6.STM32F103 (IC13.20)
SCK: 5.Teensy (IC14.50 LED11.2), 6.STM32F103 (U12.5)
SCK_STM: 4.IMU (IC8.2), 6.STM32F103 (IC13.11)
SCL: 4.IMU (IC7.19 R16.1), 5.Teensy (IC14.37)
SCL_STM: 4.IMU (U4.23), 6.STM32F103 (IC13.29)
SDA: 4.IMU (IC7.20 R14.1), 5.Teensy (IC14.38)
SDA_STM: 4.IMU (U4.24), 6.STM32F103 (IC13.30)
SHARP_ON/OFF: 1.power (IC9.4 R29.1), 5.Teensy (IC14.42)
SW1: 2.sensors (R10.1 SW1.2), 5.Teensy (IC14.58)
SW2: 2.sensors (R11.1 SW2.2), 5.Teensy (IC14.35)
TX2_STM: 2.sensors (U3.2), 6.STM32F103 (IC13.8)
TX_STM: 5.Teensy (IC14.39), 6.STM32F103 (IC13.19)
VBAT: 1.power (R40.1 U15.1), 6.STM32F103 (IC13.14)